# EAGLE board SynthEvaluationBoard (EAGLE 9.3.1), part 1 of 2
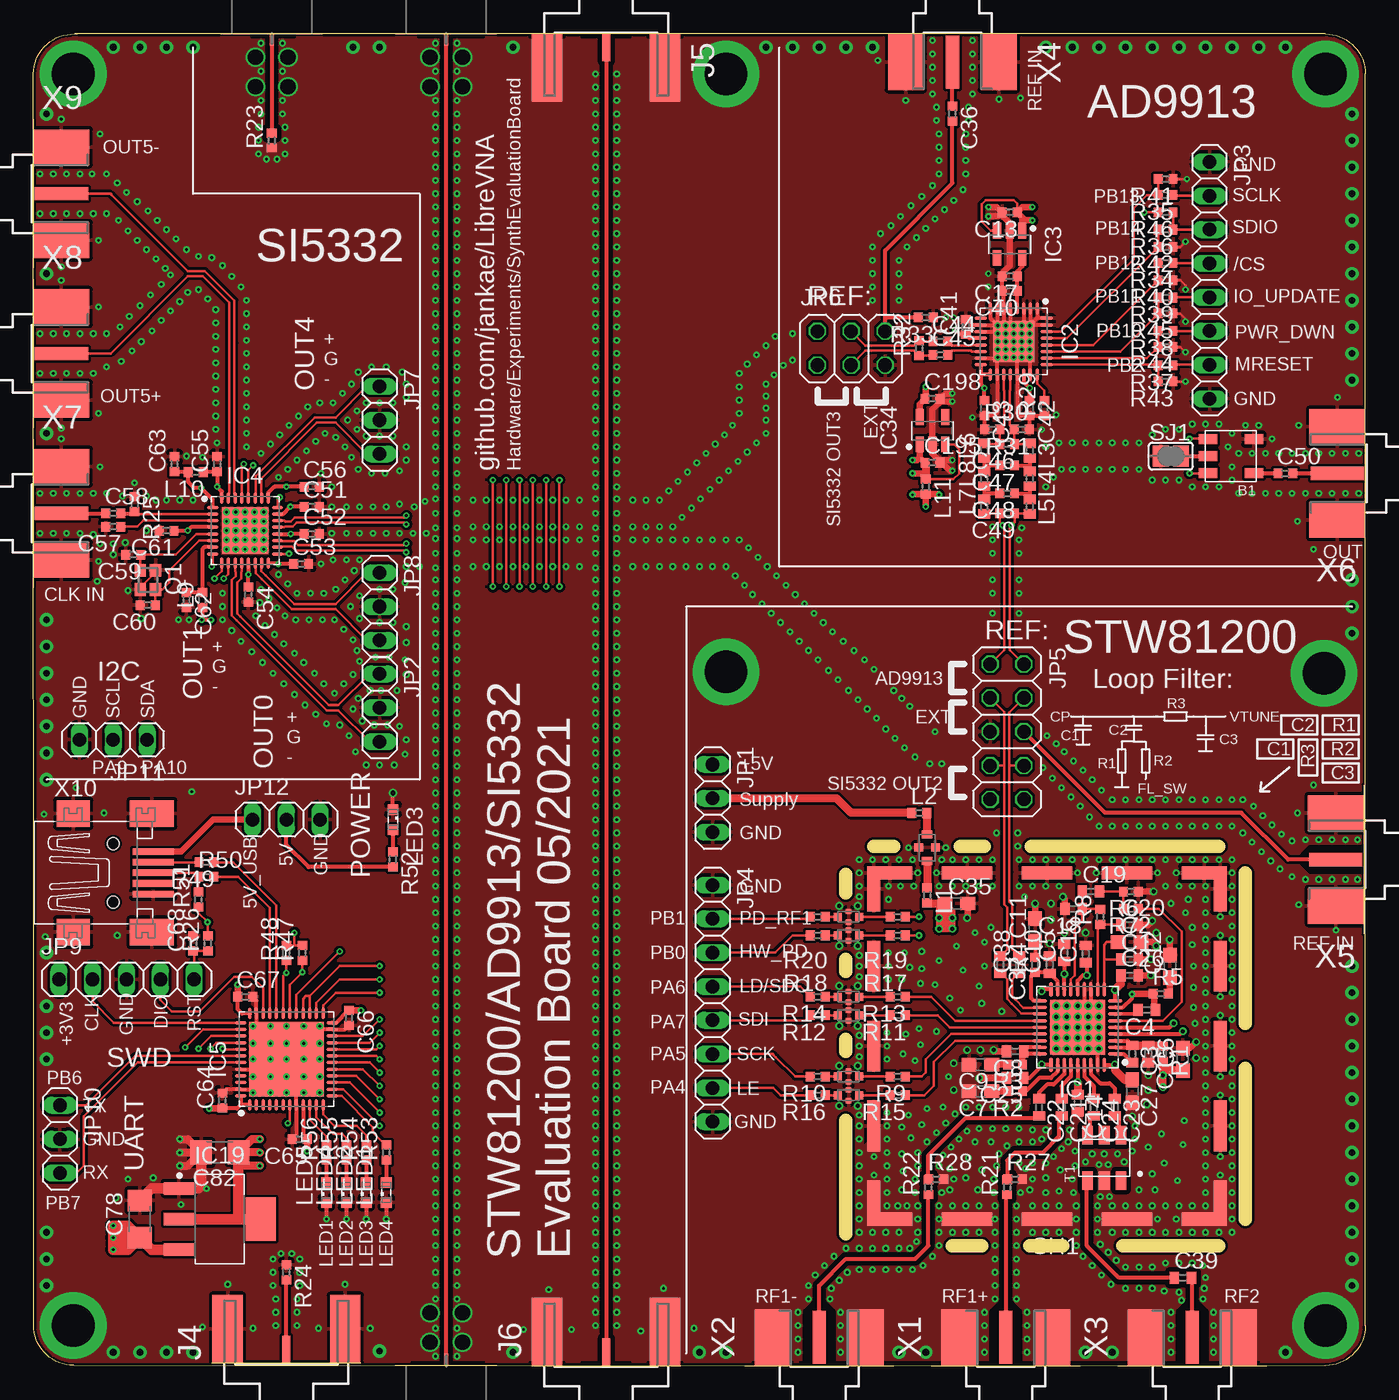
[diagram p5: board, top side]
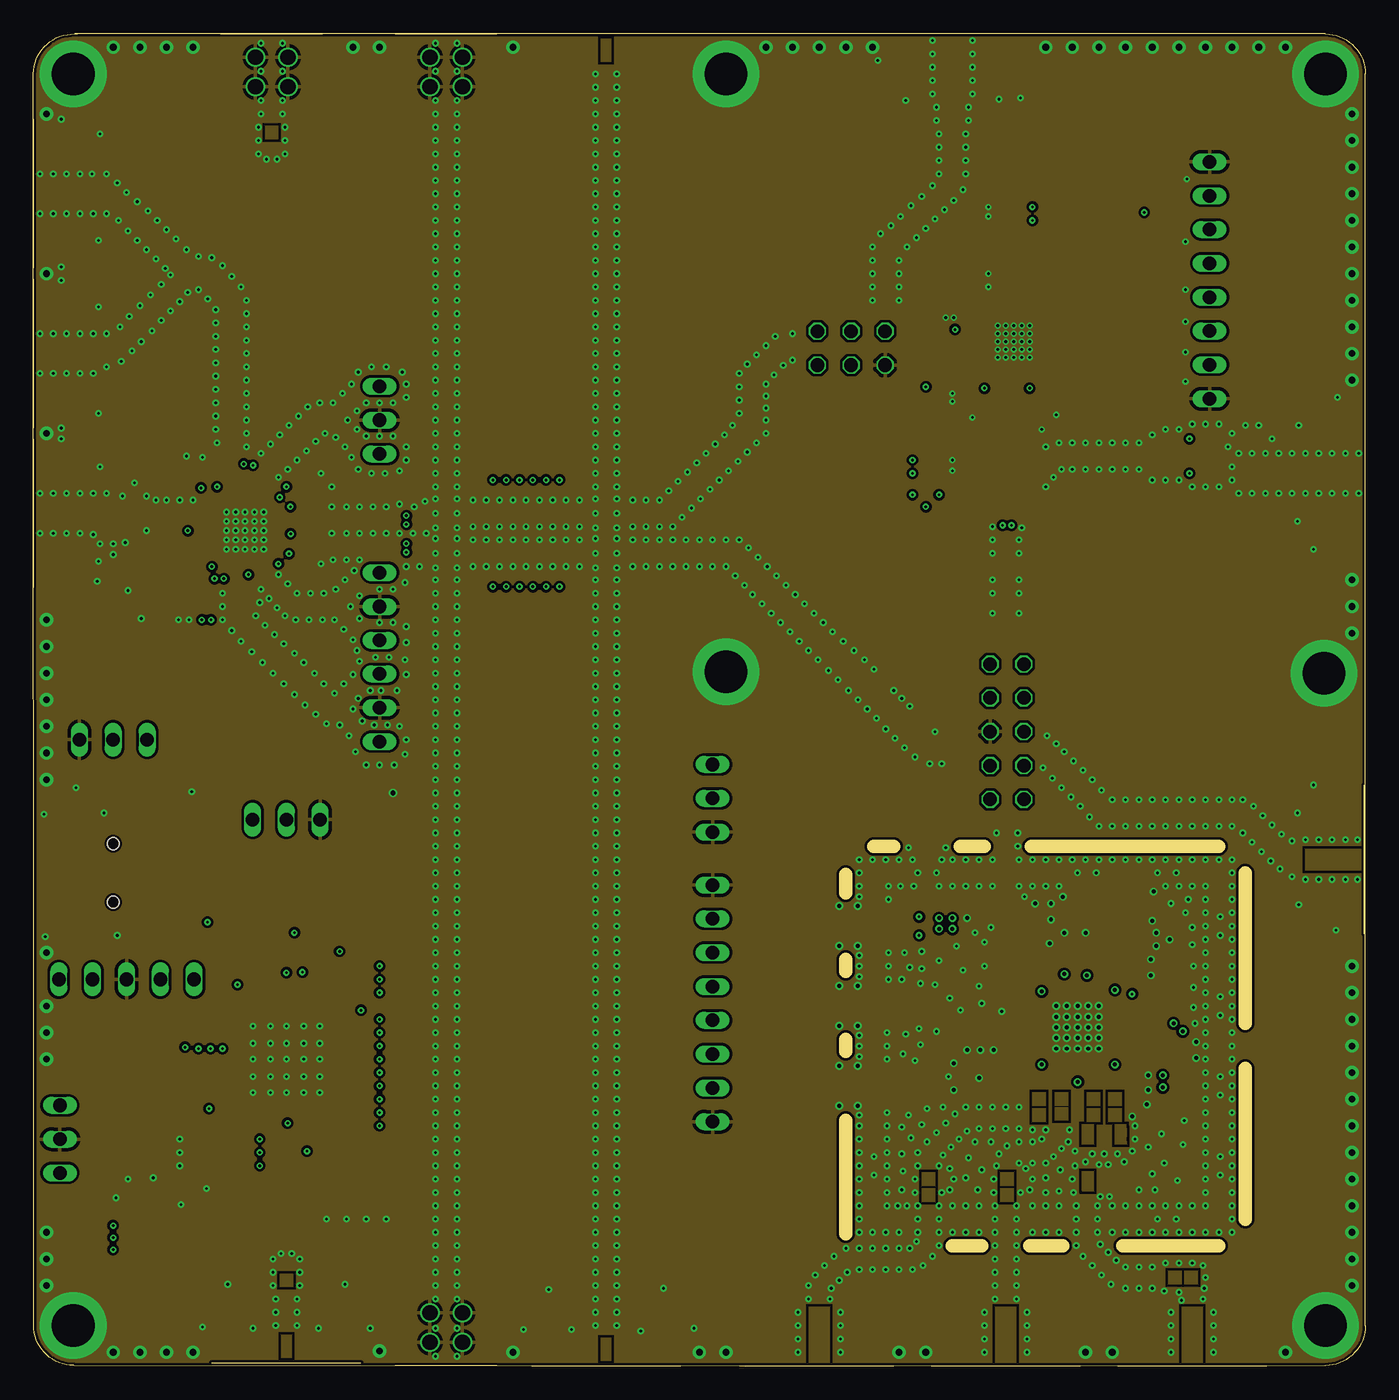
[diagram p6: board, inner layer Route2]
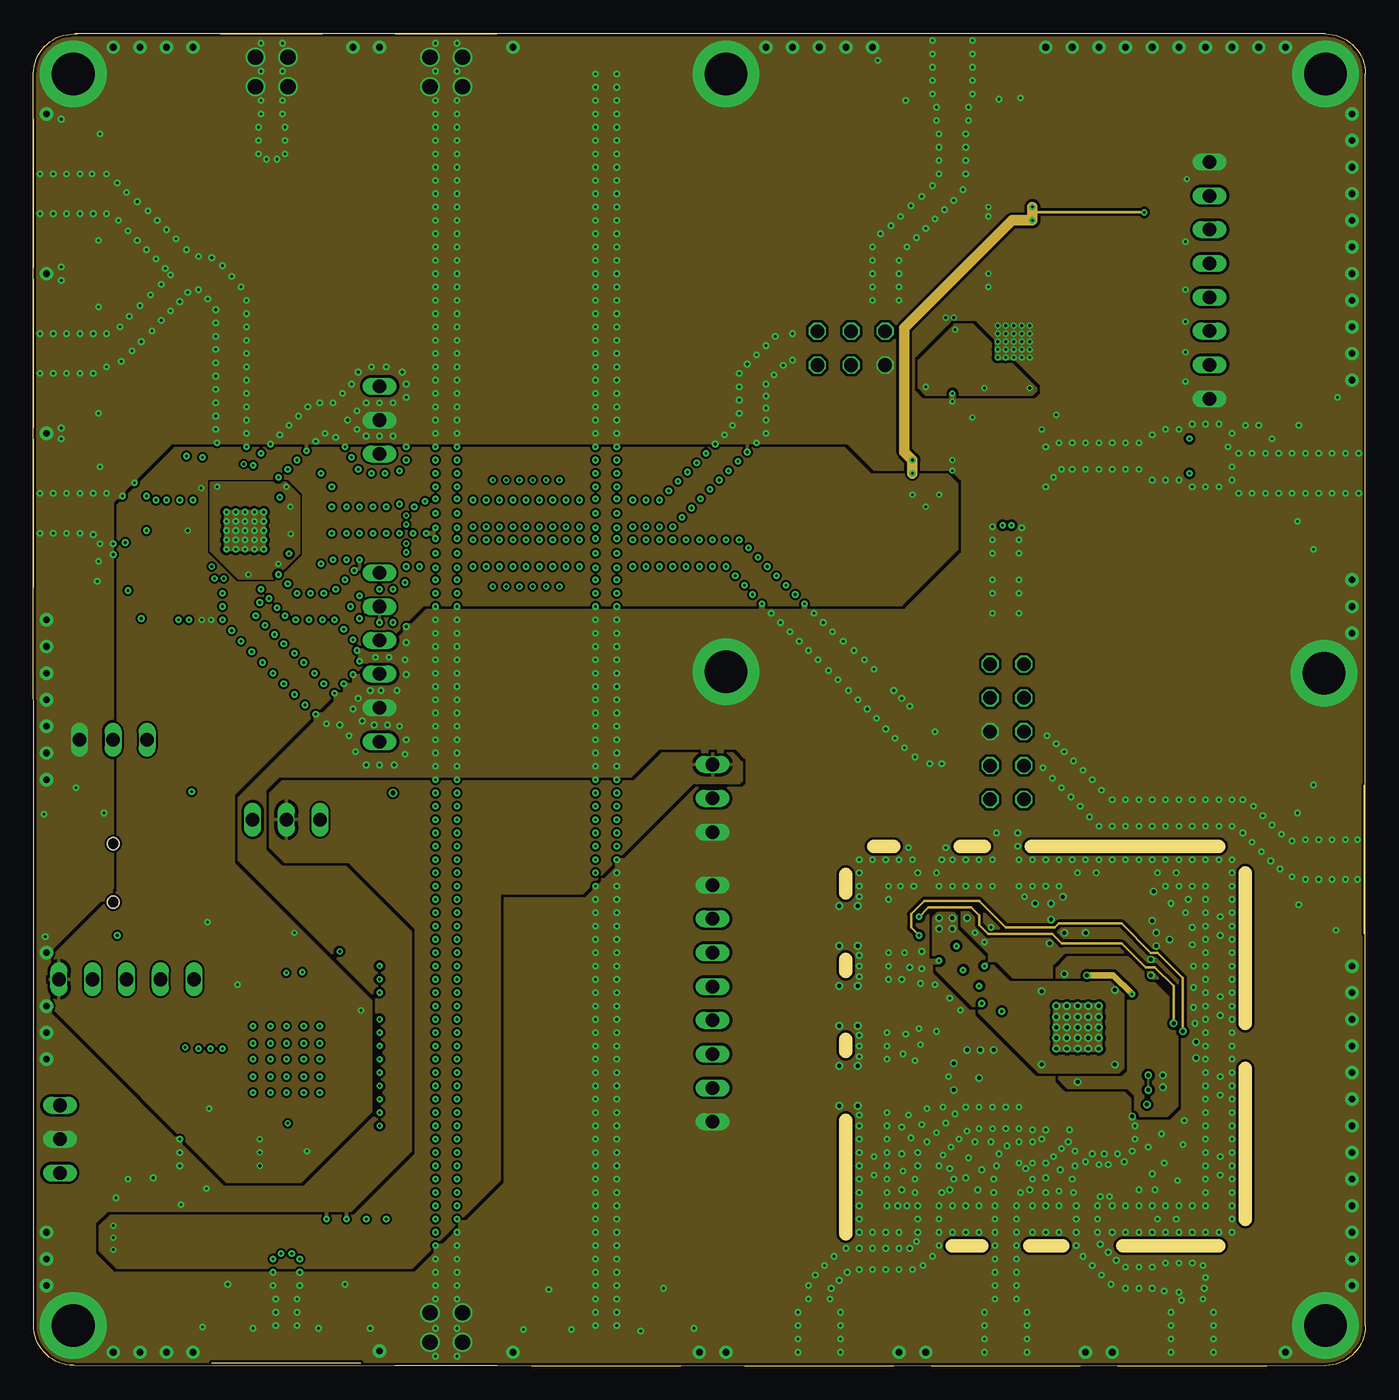
[diagram p7: board, inner layer Route15]
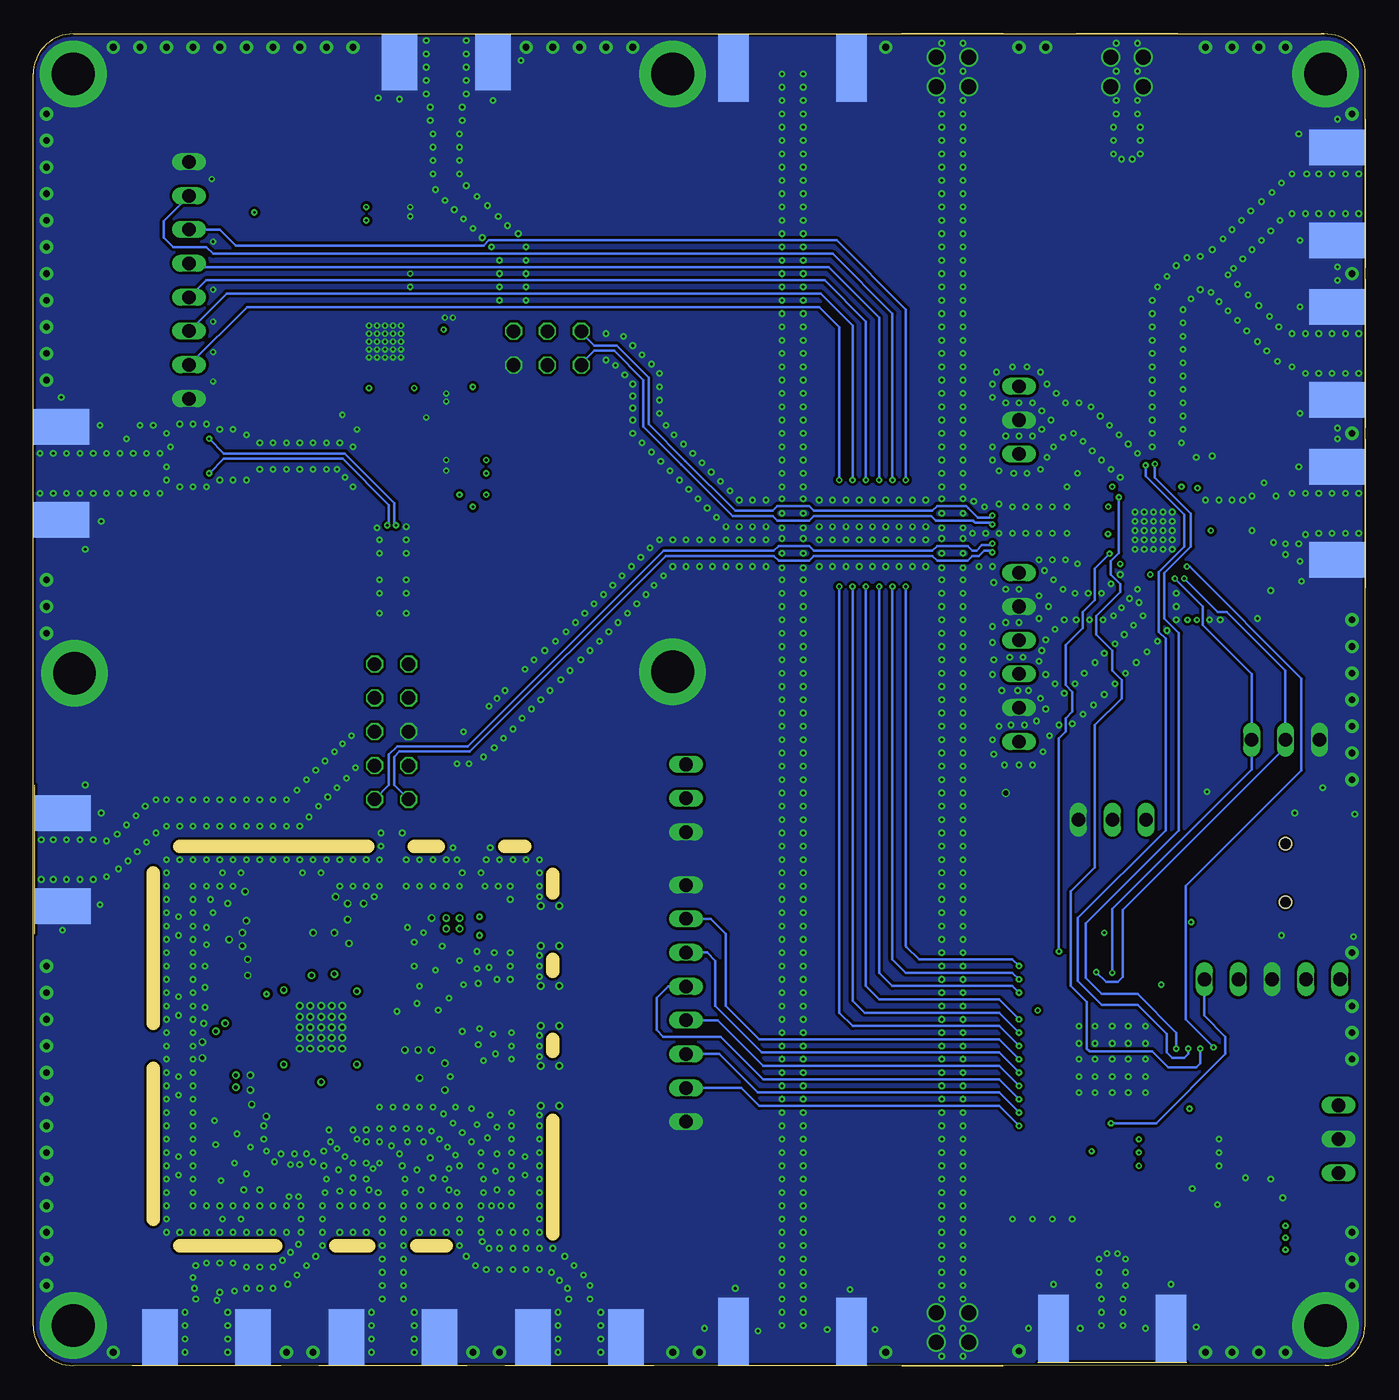
[diagram p8: board, bottom side, seen from below]

Size 100 x 100 mm. Coordinates in mm from the lower left corner, seen from the top.
Outline: 3.1,100 97,100 arc-90 100,97 100,3 arc-90 97,0 3.02,0.02 arc-90 0.02,3.02 0,97 arc-90 3.1,100
Outline: 3.1,100 3.3,100
Outline: 69,9 71.2,9
Outline: 74.8,9 77.3,9
Outline: 61,9.9 61,18.4
Outline: 61,23.6 61,24.5
Outline: 61,29.6 61,30.5
Outline: 81.8,9 89,9
Outline: 91,11 91,22.3
Outline: 91,37 91,25.7
Outline: 89,39 74.9,39
Outline: 61,35.5 61,36.9
Outline: 63.1,39 64.6,39
Outline: 69.6,39 71.4,39
Copper layers (1+2*15+16): Top 0.035mm / dielectric 0.2mm / Route2 0.0175mm / dielectric 1.064mm / Route15 0.0175mm / dielectric 0.2mm / Bottom 0.035mm
Design rules "JLCPCB4L_7628 *": minimum track width 6mil, minimum drill 0.2mm, track to track 3.5mil, track to pad 3.5mil, pad to pad 3.5mil, via to via 3.5mil, smd to smd 0mil, copper to edge 0.2mm, drill to drill 0.2mm, minimum pad ring 0.13mm, minimum via ring 0.13mm, stop-mask expansion 0.05mm, vias tented up to drill 0mil, thermal gap 10mil
Net classes: 1 100 Ohm differential: width 0.2 mm, drill 0.2 mm, clearance 0.2 mm
tRestrict: 16 lines
Milling: 12 lines

## Footprints (pad centres in the part's own frame; a part is rotated, then mirrored left to right if it is on the bottom)
SM-22 = smd 0.762 x 1.397: 1 -1.27,1.727; 2 0,1.727; 3 1.27,1.727; 4 1.27,-1.727; 5 -1.27,-1.727
C0402 = smd 0.7 x 0.9: 1 -0.65,0; 2 0.65,0
C0603 = smd 1.1 x 1: 1 -0.85,0; 2 0.85,0
C0402' = smd 0.67 x 0.72: 1 -0.56,0; 2 0.56,0
NFM18PC = smd 0.6 x 0.6: 1 -0.8,0; 3 0.8,0 | smd 0.4 x 0.4: 2 0,-0.4; 4 0,0.4
NFM21PC = smd 0.6 x 0.8: 1 -1,0; 3 1,0 | smd 0.6 x 0.65: 2 0,-0.625; 4 0,0.625
C1206 = smd 1.6 x 1.8: 1 -1.4,0; 2 1.4,0
QFN50P600X600X100-37T410N = smd 1.084 x 0.264: 1 -2.832,2; 2 -2.832,1.5; 3 -2.832,1; 4 -2.832,0.5; 5 -2.832,0; 6 -2.832,-0.5; 7 -2.832,-1; 8 -2.832,-1.5; 9 -2.832,-2; 19 2.832,-2; 20 2.832,-1.5; 21 2.832,-1; 22 2.832,-0.5; 23 2.832,0; 24 2.832,0.5; 25 2.832,1; 26 2.832,1.5; 27 2.832,2 | smd 0.264 x 1.084: 10 -2,-2.832; 11 -1.5,-2.832; 12 -1,-2.832; 13 -0.5,-2.832; 14 0,-2.832; 15 0.5,-2.832; 16 1,-2.832; 17 1.5,-2.832; 18 2,-2.832; 28 2,2.832; 29 1.5,2.832; 30 1,2.832; 31 0.5,2.832; 32 0,2.832; 33 -0.5,2.832; 34 -1,2.832; 35 -1.5,2.832; 36 -2,2.832 | smd 4.1 x 4.1: 37 0,0
QFN50P500X500X80-33T310 = smd 0.937 x 0.27: 1 -2.487,1.75; 2 -2.487,1.25; 3 -2.487,0.75; 4 -2.487,0.25; 5 -2.487,-0.25; 6 -2.487,-0.75; 7 -2.487,-1.25; 8 -2.487,-1.75; 17 2.487,-1.75; 18 2.487,-1.25; 19 2.487,-0.75; 20 2.487,-0.25; 21 2.487,0.25; 22 2.487,0.75; 23 2.487,1.25; 24 2.487,1.75 | smd 0.27 x 0.937: 9 -1.75,-2.487; 10 -1.25,-2.487; 11 -0.75,-2.487; 12 -0.25,-2.487; 13 0.25,-2.487; 14 0.75,-2.487; 15 1.25,-2.487; 16 1.75,-2.487; 25 1.75,2.487; 26 1.25,2.487; 27 0.75,2.487; 28 0.25,2.487; 29 -0.25,2.487; 30 -0.75,2.487; 31 -1.25,2.487; 32 -1.75,2.487 | smd 3.1 x 3.1: 33 0,0
SOT95P240X110-5 = smd 1.18 x 0.609: 1 -1.024,0.95; 2 -1.024,0; 3 -1.024,-0.95; 4 1.024,-0.95; 5 1.024,0.95
QFN50P500X500X100-33T345N = smd 0.86 x 0.27: 1 -2.435,1.75; 2 -2.435,1.25; 3 -2.435,0.75; 4 -2.435,0.25; 5 -2.435,-0.25; 6 -2.435,-0.75; 7 -2.435,-1.25; 8 -2.435,-1.75; 17 2.435,-1.75; 18 2.435,-1.25; 19 2.435,-0.75; 20 2.435,-0.25; 21 2.435,0.25; 22 2.435,0.75; 23 2.435,1.25; 24 2.435,1.75 | smd 0.27 x 0.86: 9 -1.75,-2.435; 10 -1.25,-2.435; 11 -0.75,-2.435; 12 -0.25,-2.435; 13 0.25,-2.435; 14 0.75,-2.435; 15 1.25,-2.435; 16 1.75,-2.435; 25 1.75,2.435; 26 1.25,2.435; 27 0.75,2.435; 28 0.25,2.435; 29 -0.25,2.435; 30 -0.75,2.435; 31 -1.25,2.435; 32 -1.75,2.435 | smd 3.45 x 3.45: 33 0,0
QFN50P700X700X60-49T560N = smd 0.86 x 0.27: 1 -3.435,2.75; 2 -3.435,2.25; 3 -3.435,1.75; 4 -3.435,1.25; 5 -3.435,0.75; 6 -3.435,0.25; 7 -3.435,-0.25; 8 -3.435,-0.75; 9 -3.435,-1.25; 10 -3.435,-1.75; 11 -3.435,-2.25; 12 -3.435,-2.75; 25 3.435,-2.75; 26 3.435,-2.25; 27 3.435,-1.75; 28 3.435,-1.25; 29 3.435,-0.75; 30 3.435,-0.25; 31 3.435,0.25; 32 3.435,0.75; 33 3.435,1.25; 34 3.435,1.75; 35 3.435,2.25; 36 3.435,2.75 | smd 0.27 x 0.86: 13 -2.75,-3.435; 14 -2.25,-3.435; 15 -1.75,-3.435; 16 -1.25,-3.435; 17 -0.75,-3.435; 18 -0.25,-3.435; 19 0.25,-3.435; 20 0.75,-3.435; 21 1.25,-3.435; 22 1.75,-3.435; 23 2.25,-3.435; 24 2.75,-3.435; 37 2.75,3.435; 38 2.25,3.435; 39 1.75,3.435; 40 1.25,3.435; 41 0.75,3.435; 42 0.25,3.435; 43 -0.25,3.435; 44 -0.75,3.435; 45 -1.25,3.435; 46 -1.75,3.435; 47 -2.25,3.435; 48 -2.75,3.435 | smd 5.6 x 5.6: 49 0,0
SOT230P700X180-4 = smd 2.265 x 0.929: 1 -3.073,2.3; 2 -3.073,0; 3 -3.073,-2.3 | smd 2.265 x 3.229: 4 3.073,0
AMPHENOL_901-10510-2 = drill 1.14 pad 1.44: G1 -1.75,1.22; G2 -3.96,1.22; G3 -3.96,-1.22; G4 -1.75,-1.22 | smd 0.9 x 0.3: S -0.45,0
BU-1420701851 = smd 2.1 x 0.6: 1 1,0 | smd 5.08 x 2.286: G@1 2.565,4.42; G@2 2.565,-4.42 | smd 5.08 x 2.286 bottom: G@3 2.565,4.42; G@4 2.565,-4.42
1X03 = drill 1.016 long: 1 -2.54,0; 2 0,0; 3 2.54,0
1X08 = drill 1.016 long: 1 -8.89,0; 2 -6.35,0; 3 -3.81,0; 4 -1.27,0; 5 1.27,0; 6 3.81,0; 7 6.35,0; 8 8.89,0
2X05 = drill 1.016 octagon: 1 -5.08,-1.27; 2 -5.08,1.27; 3 -2.54,-1.27; 4 -2.54,1.27; 5 0,-1.27; 6 0,1.27; 7 2.54,-1.27; 8 2.54,1.27; 9 5.08,-1.27; 10 5.08,1.27
2X03 = drill 1.016 octagon: 1 -2.54,-1.27; 2 -2.54,1.27; 3 0,-1.27; 4 0,1.27; 5 2.54,-1.27; 6 2.54,1.27
1X05 = drill 1.016 long: 1 -5.08,0; 2 -2.54,0; 3 0,0; 4 2.54,0; 5 5.08,0
R0402 = smd 0.67 x 0.72: 1 -0.56,0; 2 0.56,0
L0402 = smd 0.7 x 0.9: 1 -0.548,0; 2 0.548,0
LED_SML0603 = smd 0.8 x 0.8: A 0.75,0; C -0.75,0
FA-128 = smd 0.95 x 0.85: 1 -0.725,-0.575; 2 0.725,-0.575; 3 0.725,0.575; 4 -0.725,0.575
TE_2118718-2 = smd 3.4 x 1: 1 1.7,0.5; 5 25.3,0.5; 11 25.3,26.5; 15 1.7,26.5 | smd 3.8 x 1: 2 7.5,0.5; 3 13.5,0.5; 4 19.5,0.5; 12 19.5,26.5; 13 13.5,26.5; 14 7.5,26.5 | smd 1 x 3.4: 6 0.5,1.7; 10 0.5,25.3; 16 26.5,25.3; 20 26.5,1.7 | smd 1 x 3.8: 7 0.5,7.5; 8 0.5,13.5; 9 0.5,19.5; 17 26.5,19.5; 18 26.5,13.5; 19 26.5,7.5
SJ = smd 1.168 x 1.6: 1 -0.762,0; 2 0.762,0
EASTEVER_BALUN = smd 1.4 x 0.8: 1 -1.715,-1.25; 2 -1.715,0; 3 -1.715,1.25; 4 1.715,1.25; 5 1.715,0; 6 1.715,-1.25
J502-ND-142-0711-821/826 = smd 4 x 1: 1 2.115,0 | smd 4.191 x 2.667: G@1 2.115,3.495; G@2 2.115,-3.495 | smd 4.191 x 2.667 bottom: G@3 2.115,3.495; G@4 2.115,-3.495
32005-301 = smd 3.1 x 0.5: 1 3,1.6; 2 3,0.8; 3 3,0; 4 3,-0.8; 5 3,-1.6 | smd 2.5 x 2: M1 -3,-4.45; M2 -3,4.45 | smd 3.3 x 2: M3 2.9,4.45; M4 2.9,-4.45 | hole 0.9: 0,2.2; 0,-2.2

## Placement (x,y rotation side)
B1  ETC1-1T-2  [SM-22]  89.9,68.3 90 top
C1  220n  [C0402]  82.3,30.5 0 top
C2  10u  [C0603]  82.3,31.8 0 top
C3  100n  [C0402]  82.5,23.4 270 top
C4  100n  [C0402]  83.59,26.71 180 top
C5  220n  [C0402]  77.4,31 90 top
C6  10u  [C0603]  86.3,23 90 top
C7  10u  [C0603]  71.1,20.6 180 top
C8  220n  [C0402]  73.7,23.6 180 top
C9  10u  [C0603]  71.1,22.6 180 top
C10  220n  [C0402]  76.3,30.1 90 top
C11  10u  [C0603]  75.2,32.7 90 top
C12  10u  [C0603]  85.33,29.98 90 top
C13  1u  [C0402']  73.3,86.6 180 top
C14  220n  [C0402]  78.4,19.7 270 top
C15  1n  [C0402]  83.7,23.4 270 top
C16  10n  [C0402]  79,30.9 90 top
C17  1u  [C0402']  73.3,81.8 180 top
C18  DNP  [C0402]  78.1,34.3 180 top
C19  DNP  [C0402]  79.4,35.6 0 top
C20  DNP  [C0402]  82.3,33.1 0 top
C21  1n  [C0402]  77.2,19.4 270 top
C22  1n  [C0402]  75.5,19.4 270 top
C23  1n  [C0402]  81.2,19.4 270 top
C24  1n  [C0402]  79.6,19.4 270 top
C25  100n  [C0402]  73.7,21.6 180 top
C26  100n  [C0402]  82.3,29.3 0 top
C27  10u  [C0603]  82.5,20.6 270 top
C28  NFM18CC101R1C3D  [NFM18PC]  61.2,21.7 0 top
C29  NFM18CC101R1C3D  [NFM18PC]  61.2,26.3 0 top
C30  NFM18CC101R1C3D  [NFM18PC]  61.2,27.7 0 top
C31  NFM18CC101R1C3D  [NFM18PC]  61.2,20.3 0 top
C32  NFM18CC101R1C3D  [NFM18PC]  61.2,32.3 0 top
C33  NFM18CC101R1C3D  [NFM18PC]  61.2,33.7 0 top
C34  NFM21PC475B1A3D  [NFM21PC]  67.1,38.9 270 top
C35  10u  [C0603]  69.3,34.7 0 top
C36  100n  [C0402']  69,94 270 top
C37  10n  [C0402]  72.6,30.1 270 top
C38  10n  [C0402]  74,30.1 90 top
C39  1n  [C0402]  86.3,6.6 0 top
C40  100n  [C0402']  73.3,80.7 180 top
C41  100n  [C0402']  70,78 90 top
C42  100n  [C0402']  74.8,71.9 270 top
C43  100n  [C0402']  71.4,71.9 270 top
C44  100n  [C0402']  68.1,76.9 0 top
C45  100n  [C0402']  68.1,75.9 0 top
C46  12p  [C0402']  73.1,69.2 180 top
C47  47p  [C0402']  73.1,67.6 180 top
C48  47p  [C0402']  73.1,65.5 180 top
C49  12p  [C0402']  73.1,64 180 top
C50  1u  [C0402']  94,67 0 top
C51  100n  [C0402']  20.9,64.5 0 top
C52  100n  [C0402']  20.9,62.45 0 top
C53  100n  [C0402']  20.1,60.2 0 top
C54  100n  [C0402']  16.15,57.9 270 top
C55  100n  [C0402']  13.8,67.7 90 top
C56  100n  [C0402']  20.9,66 0 top
C57  100n  [C0402']  6,63 180 top
C58  100n  [C0402']  6,64 0 top
C59  4p  [C0402']  7.5,60.9 180 top
C60  4p  [C0402']  8.6,57.1 180 top
C61  100n  [C0402']  10,62.7 180 top
C62  1u  [C0402']  11.5,57.5 270 top
C63  1u  [C0402']  10.6,67.7 90 top
C64  100n  [C0402']  14.2,19.9 90 top
C65  100n  [C0402']  20,17 180 top
C66  100n  [C0402']  23.7,26.1 270 top
C67  100n  [C0402']  15.9,27.7 0 top
C68  100n  [C0402']  12,31.7 90 top
C78  10u  [C1206]  8,11 90 top
C82  10u  [C1206]  14,16 180 top
C195  1u  [C0402']  67.5,67.8 0 top
C198  1u  [C0402']  67.5,72.6 0 top
IC1  STW81200  [QFN50P600X600X100-37T410N]  78.4,25.4 180 top
IC2  AD9913  [QFN50P500X500X80-33T310]  73.6,76.9 270 top
IC3  NCP702-1.8  [SOT95P240X110-5]  73.3,84.2 270 top
IC4  SI5332A-GM1  [QFN50P500X500X100-33T345N]  15.9,62.7 0 top
IC5  STM32L462CE  [QFN50P700X700X60-49T560N]  19,23 90 top
IC19  AP2114H  [SOT230P700X180-4]  14,11 0 top
IC34  NCP702-1.8  [SOT95P240X110-5]  67.5,70.2 90 top
J1  AMPHENOL_901-10510-2  [AMPHENOL_901-10510-2]  17.9,100 90 top
J2  AMPHENOL_901-10510-2  [AMPHENOL_901-10510-2]  31,0 270 top
J3  AMPHENOL_901-10510-2  [AMPHENOL_901-10510-2]  31,100 90 top
J4  BU-1420701851  [BU-1420701851]  19,0.2 90 top
J5  BU-1420701851  [BU-1420701851]  43,100 270 top
J6  BU-1420701851  [BU-1420701851]  43,0 90 top
JP1  [1X03]  51,42.6 270 top
JP2  [1X03]  26,49.4 270 top
JP3  [1X08]  88.3,81.5 270 top
JP4  [1X08]  51,27.2 270 top
JP5  [2X05]  73.1,47.6 270 top
JP6  [2X03]  61.4,76.4 0 top
JP7  [1X03]  26,71 270 top
JP8  [1X03]  26,57 270 top
JP9  [1X05]  7,29 0 top
JP10  [1X03]  2,17 270 top
JP11  [1X03]  6,47 180 top
JP12  [1X03]  19,41 0 top
L1  FERRITE  [R0402]  67.1,35.3 270 top
L2  FERRITE  [R0402]  66.5,41.5 0 top
L3  LQW15AWR16J80D  [L0402]  74.8,68.7 270 top
L4  LQW15CAR27J00D  [L0402]  74.8,66.6 270 top
L5  LQW15AWR16J80D  [L0402]  74.8,64.5 270 top
L6  LQW15AWR16J80D  [L0402]  71.4,68.7 90 top
L7  LQW15AWR16J80D  [L0402]  71.4,64.5 90 top
L8  LQW15CAR27J00D  [L0402]  71.4,66.6 90 top
L9  FERRITE  [R0402]  12.7,57.5 90 top
L10  FERRITE  [R0402]  12.2,67.1 180 top
L11  FERRITE  [R0402]  67,66 270 top
LED1  Green  [LED_SML0603]  26.5,13 90 top
LED2  Green  [LED_SML0603]  25,13 90 top
LED3  Green  [LED_SML0603]  27,41 270 top
LED4  Green  [LED_SML0603]  23.5,13 90 top
LED5  Green  [LED_SML0603]  22,13 90 top
Q1  FA-128 26MHz  [FA-128]  8.6,59 270 top
R1  0R2  [R0402]  84.8,23.4 270 top
R2  0R5  [R0402]  73.7,20.6 180 top
R3  0R5  [R0402]  73.7,22.6 180 top
R4  0R5  [R0402]  75.2,30.1 90 top
R5  0R2  [R0402]  84.65,27.93 0 top
R6  DNP  [R0402]  82.4,35.6 180 top
R7  DNP  [R0402]  82.4,34.3 180 top
R8  DNP  [R0402]  80.1,33.7 90 top
R9  22  [R0402]  64.9,21.7 180 top
R10  22  [R0402]  58.9,21.7 180 top
R11  22  [R0402]  64.9,26.3 180 top
R12  22  [R0402]  58.9,26.3 180 top
R13  22  [R0402]  64.9,27.7 180 top
R14  22  [R0402]  58.9,27.7 180 top
R15  22  [R0402]  64.9,20.3 180 top
R16  22  [R0402]  58.9,20.3 180 top
R17  22  [R0402]  64.9,32.3 180 top
R18  22  [R0402]  58.9,32.3 180 top
R19  22  [R0402]  64.9,33.7 180 top
R20  22  [R0402]  58.9,33.7 180 top
R21  0  [R0402]  73.1,13.4 90 top
R22  0  [R0402]  67.2,13.4 90 top
R23  49R9  [R0402]  17.9,92 90 top
R24  49R9  [R0402]  19,7 270 top
R25  49R9  [R0402]  7.6,64.7 270 top
R26  10k  [R0402]  13.1,31.7 90 top
R27  DNP  [R0402]  73.7,14 0 top
R28  DNP  [R0402]  67.8,14 0 top
R29  4k64  [R0402]  75.9,71.9 90 top
R30  49R9  [R0402]  72,70.3 0 top
R31  49R9  [R0402]  74.2,70.3 180 top
R32  100  [R0402]  66.5,76.4 90 top
R33  100  [R0402]  67,78.7 180 top
R34  1k  [R0402]  85,82.8 180 top
R35  1k  [R0402]  85,87.9 180 top
R36  1k  [R0402]  85,85.3 180 top
R37  1k  [R0402]  85,75.1 180 top
R38  1k  [R0402]  85,77.7 180 top
R39  1k  [R0402]  85,80.2 180 top
R40  1k  [R0402]  85,81.5 180 top
R41  1k  [R0402]  85,89.1 180 top
R42  1k  [R0402]  85,84 180 top
R43  1k  [R0402]  85,73.9 180 top
R44  1k  [R0402]  85,76.5 180 top
R45  1k  [R0402]  85,79 180 top
R46  1k  [R0402]  85,86.6 180 top
R47  4k7  [R0402]  20.2,31 90 top
R48  4k7  [R0402]  19,31 90 top
R49  22  [R0402]  13,37.8 180 top
R50  22  [R0402]  13,36.7 0 top
R51  1k5  [R0402]  12.4,35 90 top
R52  470  [R0402]  27,38 270 top
R53  220  [R0402]  26.5,16 90 top
R54  220  [R0402]  25,16 90 top
R55  220  [R0402]  23.5,16 90 top
R56  220  [R0402]  22,16 90 top
SH1  TE_2118718-2  [TE_2118718-2]  89.6,37.5 180 top
SJ1  [SJ]  85.4,68.3 0 top
T1  B012-617DB-1-63-B331  [EASTEVER_BALUN]  80.4,15.6 90 top
X1  SMA_CONNECTOR  [J502-ND-142-0711-821/826]  73,0 90 top
X2  SMA_CONNECTOR  [J502-ND-142-0711-821/826]  59,0 90 top
X3  SMA_CONNECTOR  [J502-ND-142-0711-821/826]  87,0 90 top
X4  SMA_CONNECTOR  [J502-ND-142-0711-821/826]  69,100 270 top
X5  SMA_CONNECTOR  [J502-ND-142-0711-821/826]  99.9,38 180 top
X6  SMA_CONNECTOR  [J502-ND-142-0711-821/826]  100,67 180 top
X7  SMA_CONNECTOR  [J502-ND-142-0711-821/826]  0,64 0 top
X8  SMA_CONNECTOR  [J502-ND-142-0711-821/826]  0,76 0 top
X9  SMA_CONNECTOR  [J502-ND-142-0711-821/826]  0,88 0 top
X10  MINI-USB-SCHIELD-32005-301  [32005-301]  6,37 0 top